# Altium schematic sheet MCU.SchDoc
size Letter; SheetNumber: 3; SheetTotal: 5
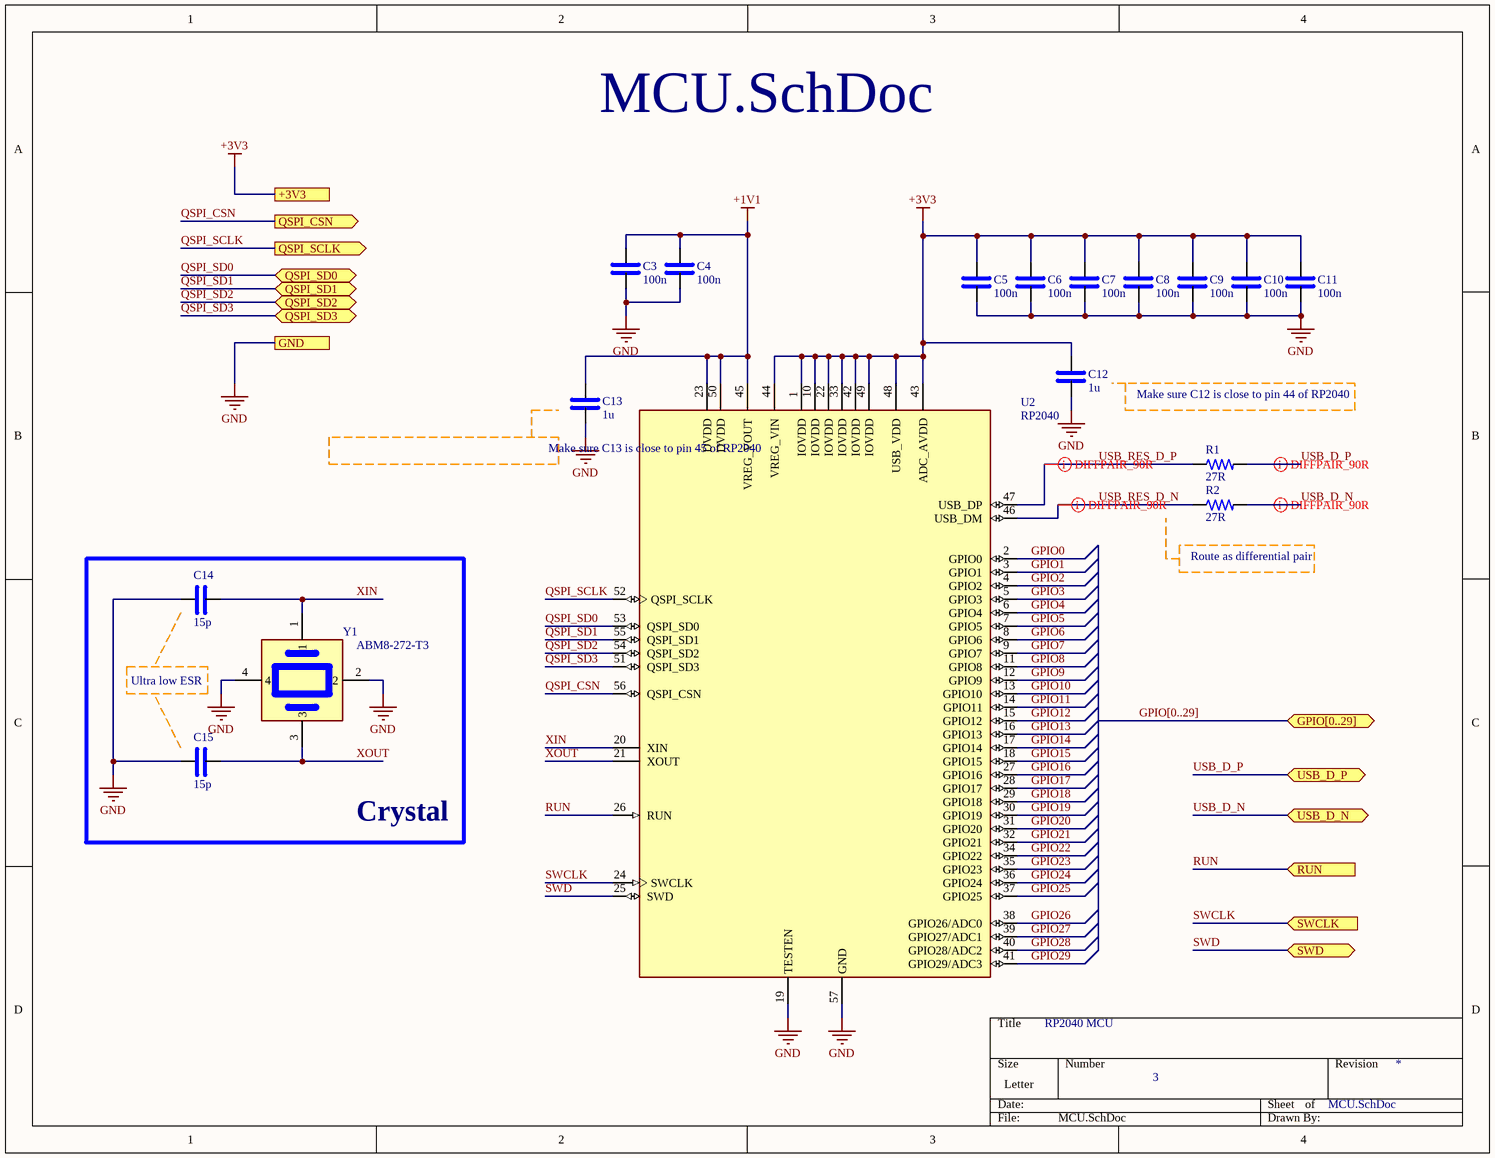
[diagram p0: MCU.SchDoc]

## Parts
C3  100n  [0402 CAP]
C4  100n  [0402 CAP]
C5  100n  [0402 CAP]
C6  100n  [0402 CAP]
C7  100n  [0402 CAP]
C8  100n  [0402 CAP]
C9  100n  [0402 CAP]
C10  100n  [0402 CAP]
C11  100n  [0402 CAP]
C12  1u  [0402 CAP]
C13  1u  [0402 CAP]
C14  15p  [0402 CAP]
C15  15p  [0402 CAP]
R1  27R  [0402 RES]
R2  27R  [0402 RES]
U2  RP2040  [QFN40P700X700X90-57N]
Y1  ABM8-272-T3  [ABM8-272-T3]

## Blocks framed on the sheet
Crystal: C14 C15 Y1

## Ports
+3V3 (see Master[2B], Connectors[3B], Flash[4B], Supply[4B]), GND (see Master[2C], Connectors[3C], Flash[4C], Supply[4C]), GPIO[0..29] (bidir, see Master[3B], Connectors[3C]), QSPI_CSN (out, see Master[3C], Flash[4B]), QSPI_SCLK (out, see Master[3C], Flash[4B]), QSPI_SD0 (bidir, see Master[3C], Flash[4B]), QSPI_SD1 (bidir, see Master[3C], Flash[4B]), QSPI_SD2 (bidir, see Master[3C], Flash[4B]), QSPI_SD3 (bidir, see Master[3C], Flash[4B]), RUN (in, see Master[3B], Connectors[3C]), SWCLK (in, see Master[3B], Connectors[3C]), SWD (bidir, see Master[3B], Connectors[3C]), USB_D_N (bidir, see Master[2C], Supply[4B]), USB_D_P (bidir, see Master[2C], Supply[4B])

## Nets
+1V1: C3.2 C4.2 C13.2 U2.23(DVDD) U2.45(VREG_VOUT) U2.50(DVDD)
+3V3: C5.2 C6.2 C7.2 C8.2 C9.2 C10.2 C11.2 C12.2 U2.1(IOVDD) U2.10(IOVDD) U2.22(IOVDD) U2.33(IOVDD) U2.42(IOVDD) U2.43(ADC_AVDD) U2.44(VREG_VIN) U2.48(USB_VDD) U2.49(IOVDD) ; port +3V3
GND: C3.1 C4.1 C5.1 C6.1 C7.1 C8.1 C9.1 C10.1 C11.1 C12.1 C13.1 C14.2 C15.2 U2.19(TESTEN) U2.57(GND) Y1.2 Y1.4 ; port GND
GPIO0: U2.2(GPIO0)
GPIO1: U2.3(GPIO1)
GPIO2: U2.4(GPIO2)
GPIO3: U2.5(GPIO3)
GPIO4: U2.6(GPIO4)
GPIO5: U2.7(GPIO5)
GPIO6: U2.8(GPIO6)
GPIO7: U2.9(GPIO7)
GPIO8: U2.11(GPIO8)
GPIO9: U2.12(GPIO9)
GPIO10: U2.13(GPIO10)
GPIO11: U2.14(GPIO11)
GPIO12: U2.15(GPIO12)
GPIO13: U2.16(GPIO13)
GPIO14: U2.17(GPIO14)
GPIO15: U2.18(GPIO15)
GPIO16: U2.27(GPIO16)
GPIO17: U2.28(GPIO17)
GPIO18: U2.29(GPIO18)
GPIO19: U2.30(GPIO19)
GPIO20: U2.31(GPIO20)
GPIO21: U2.32(GPIO21)
GPIO22: U2.34(GPIO22)
GPIO23: U2.35(GPIO23)
GPIO24: U2.36(GPIO24)
GPIO25: U2.37(GPIO25)
GPIO26: U2.38(GPIO26/ADC0)
GPIO27: U2.39(GPIO27/ADC1)
GPIO28: U2.40(GPIO28/ADC2)
GPIO29: U2.41(GPIO29/ADC3)
QSPI_CSN: U2.56(QSPI_CSN) ; port QSPI_CSN
QSPI_SCLK: U2.52(QSPI_SCLK) ; port QSPI_SCLK
QSPI_SD0: U2.53(QSPI_SD0) ; port QSPI_SD0
QSPI_SD1: U2.55(QSPI_SD1) ; port QSPI_SD1
QSPI_SD2: U2.54(QSPI_SD2) ; port QSPI_SD2
QSPI_SD3: U2.51(QSPI_SD3) ; port QSPI_SD3
RUN: U2.26(RUN) ; port RUN
SWCLK: U2.24(SWCLK) ; port SWCLK
SWD: U2.25(SWD) ; port SWD
USB_D_N: R2.2 ; port USB_D_N
USB_D_P: R1.2 ; port USB_D_P
USB_RES_D_N: R2.1 U2.46(USB_DM)
USB_RES_D_P: R1.1 U2.47(USB_DP)
XIN: C14.1 U2.20(XIN) Y1.1
XOUT: C15.1 U2.21(XOUT) Y1.3

## Buses and harness runs
bus GPIO[0..29] = port GPIO[0..29]

## Layout directives
differential pair; differential pair class USB: USB_D_N, USB_D_P, USB_RES_D_N, USB_RES_D_P

## Notes on the sheet
- Make sure C12 is close to pin 44 of RP2040
- (near C13) Make sure C13 is close to pin 45 of RP2040
- (near R2) Route as differential pair
- Ultra low ESR
- RP2040 MCU

## Library data of the parts
C3-C11 = 0402 SMD Capacitor: Ceramic Capacitor, Multilayer, Ceramic, 16V, 10% +Tol, 10% -Tol, X7R, 15% TC, 0.1uF, Surface Mount, 0805; Manufacturer: KEMET; Manufacturer Part Number: C0805C104K4RACTU; Value: 100nF; Multilayer: Yes; ComponentLink1Description: Link; ComponentLink1URL: *; Supplier: Mouser; Supplier Part Number: 80-C0805C104K4R; RoHS: Yes; Category: Ceramic Capacitors; Stock: 114893; Pricing: 1=0.16, 10=0.078, 50=0.078, 100=0.045, 1000=0.034, 10000=0.024 (USD); Mounting Technology: Surface Mount; Pins: 2; Dielectric Material: Ceramic; Package Shape: Rectangular; Case/Package: 0805; Terminal Finish: Nickel; Min Operating Temperature: -55°C; Max Operating Temperature: 125°C; JESD-609 Code: e3; Capacitor Type: Ceramic; Tolerance  (fill in as +-): 10%; Packaging: Tape and Reel; Tolerance (fill in as +-): 10%; Rated DC Voltage (URdc): 16V; Temperature Characteristics Code: X7R; Termination: Wraparound; Reach SVHC Compliant: Yes; RoHS Compliant: Yes; ComponentLink2URL: https://datasheet.ciiva.com:443/pdfs/VipMasterIC/IC/KEME/KEME-S-A0006434815/KEME-S-A0006434815-1.pdf?src-supplier=IHS+Markit; ComponentLink2Description: https://datasheet.ciiva.com:443/pdfs/VipMasterIC/IC/KEME/KEME-S-A0006434815/KEME-S-A0006434815-1.pdf?src-supplier=IHS+Markit; ComponentLink3URL: https://datasheet.ciiva.com/46443/1851736-46443711.pdf?src-supplier=Element14; ComponentLink3Description: https://datasheet.ciiva.com/46443/1851736-46443711.pdf?src-supplier=Element14; ComponentLink4URL: https://datasheet.ciiva.com/46443/1851736-46443710.pdf?src-supplier=Element14; ComponentLink4Description: https://datasheet.ciiva.com/46443/1851736-46443710.pdf?src-supplier=Element14
C12 C13 = 0402 SMD Capacitor: Ceramic Capacitor, Multilayer, Ceramic, 16V, 10% +Tol, 10% -Tol, X7R, 15% TC, 1uF, Surface Mount, 0805; Manufacturer: KEMET; Manufacturer Part Number: C0805C105K4RACTU; Multilayer: Yes; ComponentLink1Description: Link; ComponentLink1URL: *; Supplier: Mouser; Supplier Part Number: 80-C0805C105K4R; RoHS: Yes; Category: Ceramic Capacitors; Stock: 298617; Pricing: 1=0.11, 10=0.07, 50=0.07, 100=0.046, 1000=0.041, 10000=0.018 (USD); Mounting Technology: Surface Mount; Pins: 2; Dielectric Material: Ceramic; Package Shape: Rectangular; Case/Package: 0805; Terminal Finish: Nickel; Min Operating Temperature: -55°C; Max Operating Temperature: 125°C; JESD-609 Code: e3; Value: 1uF; Capacitor Type: Ceramic; Tolerance  (fill in as +-): 10%; Packaging: Tape and Reel; Tolerance (fill in as +-): 10%; Rated DC Voltage (URdc): 16V; Temperature Characteristics Code: X7R; Termination: Wraparound; Package Style: SMTMeter; Length: 2mm; Width: 1.25mm; Height: 0.9mm; Reach SVHC Compliant: Yes; RoHS Compliant: Yes; ComponentLink2URL: https://datasheet.ciiva.com:443/pdfs/VipMasterIC/IC/KEME/KEME-S-A0008991654/KEME-S-A0008991654-1.pdf?src-supplier=IHS+Markit; ComponentLink2Description: https://datasheet.ciiva.com:443/pdfs/VipMasterIC/IC/KEME/KEME-S-A0008991654/KEME-S-A0008991654-1.pdf?src-supplier=IHS+Markit; ComponentLink3URL: https://datasheet.ciiva.com/6074/1722731-6074364.pdf?src-supplier=Farnell; ComponentLink3Description: https://datasheet.ciiva.com/6074/1722731-6074364.pdf?src-supplier=Farnell; ComponentLink4URL: https://datasheet.ciiva.com/28692/1851736-28692942.pdf?src-supplier=Element14; ComponentLink4Description: https://datasheet.ciiva.com/28692/1851736-28692942.pdf?src-supplier=Element14; ComponentLink5URL: https://datasheet.ciiva.com/14585/70095383-14585511.pdf?src-supplier=Allied+Electronics; ComponentLink5Description: https://datasheet.ciiva.com/14585/70095383-14585511.pdf?src-supplier=Allied+Electronics; ComponentLink6URL: https://datasheet.ciiva.com/14603/70095383-14603388.pdf?src-supplier=Allied+Electronics; ComponentLink6Description: https://datasheet.ciiva.com/14603/70095383-14603388.pdf?src-supplier=Allied+Electronics; ComponentLink7URL: https://datasheet.ciiva.com/45846/docfinderpartnumberc0402c102k5ractu-45846934.pdf?src-supplier=Onlinecomponents.com; ComponentLink7Description: https://datasheet.ciiva.com/45846/docfinderpartnumberc0402c102k5ractu-45846934.pdf?src-supplier=Onlinecomponents.com
C14 C15 = 0402 SMD Capacitor: Ceramic Capacitor, Multilayer, Ceramic, 50V, 1% +Tol, 1% -Tol, C0G, 30ppm/Cel TC, 0.000015uF, Surface Mount, 0805; Manufacturer: Yageo; Manufacturer Part Number: CC0805FRNPO9BN150; Value: 15pF; Multilayer: Yes; ComponentLink1Description: Link; ComponentLink1URL: *; Supplier: Future Electronics; Supplier Part Number: 8396681; RoHS: Yes; Category: Ceramic Capacitors; Stock: 8000; Pricing: 4000=0.0258, 12000=0.0252, 20000=0.0249, 60000=0.0243, 100000=0.0238 (USD); Mounting Technology: Surface Mount; Pins: 2; Dielectric Material: Ceramic; Package Shape: Rectangular; Case/Package: 0805; Terminal Finish: Nickel; Min Operating Temperature: -55°C; Max Operating Temperature: 125°C; JESD-609 Code: e3; Capacitor Type: Ceramic; Tolerance  (fill in as +-): 1%; Package Style: SMTMeter; Packaging: Tape and Reel; Tolerance (fill in as +-): 1%; Rated DC Voltage (URdc): 50V; Temperature Characteristics Code: C0G; Termination: Wraparound; Length: 2mm; Width: 1.25mm; Height: 0.6mm; Reach SVHC Compliant: Yes; RoHS Compliant: Yes; ComponentLink2URL: https://datasheet.ciiva.com:443/pdfs/VipMasterIC/IC/YAGO/YAGO-S-A0009251638/YAGO-S-A0009251638-1.pdf?src-supplier=IHS+Markit; ComponentLink2Description: https://datasheet.ciiva.com:443/pdfs/VipMasterIC/IC/YAGO/YAGO-S-A0009251638/YAGO-S-A0009251638-1.pdf?src-supplier=IHS+Markit; ComponentLink3URL: https://datasheet.ciiva.com/26862/getdatasheetpartid-251794-26862901.pdf?src-supplier=Verical; ComponentLink3Description: https://datasheet.ciiva.com/26862/getdatasheetpartid-251794-26862901.pdf?src-supplier=Verical
R1 R2 = 0402 SMD Resistor: Fixed Resistor, Thin Film, 0.125W, 27ohm, 150V, 0.1% +/-Tol, 25ppm/Cel, Surface Mount, 0805; Manufacturer: Yageo; Manufacturer Part Number: RT0805BRD0727RL; Additional Feature: HIGH PRECISION; Power: 125mW; Rated Temperature: 70°C; Temperature Coefficient: 25ppm/°C; Package Height: 0.5mm; Package Length: 2mm; Package Width: 1.25mm; ComponentLink1Description: Link; ComponentLink1URL: *; Supplier: Digikey; Supplier Part Number: 13-RT0805BRD0727RLCT-ND; RoHS: Yes; Category: Chip SMD Resistors; Stock: 1042; Pricing: 1=0.16, 10=0.122, 50=0.0968, 100=0.0867, 500=0.0663, 1000=0.05814 (USD); Mounting Technology: Surface Mount; Pins: 2; Case/Package: 0805; Min Operating Temperature: -55°C; Max Operating Temperature: 155°C; Resistor Type: FIXED RESISTOR; Construction: Chip; Package Style: SMTMeter; Packaging: Tape and Reel; Value: 27R; Technology: THIN FILM; Termination: Wraparound; Working Voltage: 150V; Reach SVHC Compliant: Yes; RoHS Compliant: Yes; ComponentLink2URL: https://datasheet.ciiva.com:443/pdfs/VipMasterIC/IC/YAGO/YAGO-S-A0008510989/YAGO-S-A0008510989-1.pdf?src-supplier=IHS+Markit; ComponentLink2Description: https://datasheet.ciiva.com:443/pdfs/VipMasterIC/IC/YAGO/YAGO-S-A0008510989/YAGO-S-A0008510989-1.pdf?src-supplier=IHS+Markit; ComponentLink3URL: https://datasheet.ciiva.com/2584/pyu-rt-1-to-0-05-rohs-l-5-2584897.pdf?src-supplier=Digikey; ComponentLink3Description: https://datasheet.ciiva.com/2584/pyu-rt-1-to-0-05-rohs-l-5-2584897.pdf?src-supplier=Digikey; ComponentLink4URL: https://datasheet.ciiva.com/12704/pyu-rt-1-to-0-05-rohs-l-4-12704026.pdf?src-supplier=Mouser; ComponentLink4Description: https://datasheet.ciiva.com/12704/pyu-rt-1-to-0-05-rohs-l-4-12704026.pdf?src-supplier=Mouser
U2 = RP2040: RP2040 chip for Raspberry Pi Pico - ARM® Cortex®-M0+ MCU 32-Bit; SnapEDA_Link: https://www.snapeda.com/parts/RP2040/Raspberry+Pi/view-part/?ref=snap; Package: None; Value: *; MF: Raspberry Pi; MP: RP2040; Check_prices: https://www.snapeda.com/parts/RP2040/Raspberry+Pi/view-part/?ref=eda
Y1 = ABM8-272-T3: 12 MHz Â±30ppm Crystal 10pF 50 Ohms 4-SMD, No Lead; MF: ABRACON; SnapEDA_Link: https://www.snapeda.com/parts/ABM8-272-T3/Abracon/view-part/?ref=snap; Package: SMD-4 Abracon; Value: *; MP: ABM8-272-T3; Check_prices: https://www.snapeda.com/parts/ABM8-272-T3/Abracon/view-part/?ref=eda